# Altium schematic sheet TMC2208.SchDoc
size B
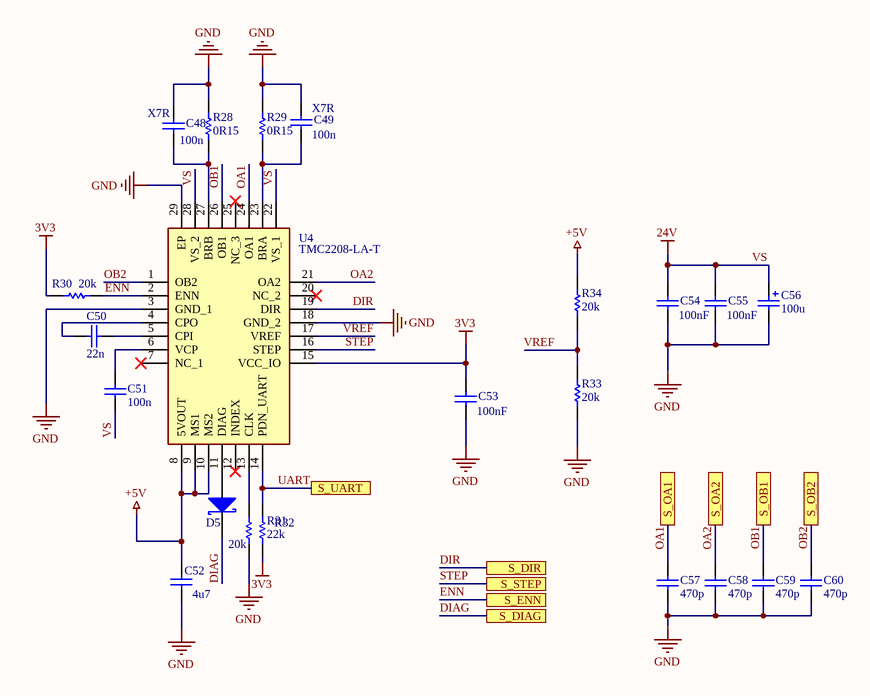
[diagram p0: TMC2208.SchDoc]

## Parts
C48  X7R  value 100n  [RAD-0.3]
C49  X7R  value 100n  [RAD-0.3]
C50  value 22n  [RAD-0.3]  (hidden comment: X5R)
C51  value 100n  [RAD-0.3]  (hidden comment: X5R)
C52  value 4u7  [RAD-0.3]  (hidden comment: X5R)
C53  value 100nF  [RAD-0.3]  (hidden comment: X5R)
C54  value 100nF  [RAD-0.3]  (hidden comment: X5R)
C55  value 100nF  [RAD-0.3]  (hidden comment: X5R)
C56  100u  [TAN-B]
C57  value 470p  [RAD-0.3]  (hidden comment: X5R)
C58  value 470p  [RAD-0.3]  (hidden comment: X5R)
C59  value 470p  [RAD-0.3]  (hidden comment: X5R)
C60  value 470p  [RAD-0.3]  (hidden comment: X5R)
D5  Diode BAT17  [SOT-23_N]  (value not drawn)
R28  value 0R15  [AXIAL-0.3]  (hidden comment: Res1)
R29  value 0R15  [AXIAL-0.3]  (hidden comment: Res1)
R30  value 20k  [AXIAL-0.3]  (hidden comment: Res1)
R31  value 22k  [AXIAL-0.3]  (hidden comment: Res1)
R32  value 20k  [AXIAL-0.3]  (hidden comment: Res1)
R33  value 20k  [AXIAL-0.3]  (hidden comment: Res1)
R34  value 20k  [AXIAL-0.3]  (hidden comment: Res1)
U4  TMC2208-LA-T  [QFN50P500X500X90-29N-D]

## Ports
S_DIAG, S_DIR, S_ENN, S_OA1, S_OA2, S_OB1, S_OB2, S_STEP, S_UART

## Nets
3V3: C53.1 R30.1 R31.1 U4.15(VCC_IO)
+5V: C52.1 R34.2 U4.8(5VOUT) U4.9(MS1) U4.10(MS2)
GND: C48.2 C49.1 C52.2 C53.2 C54.2 C55.2 C56.2 C57.1 C58.1 C59.1 C60.1 R28.2 R29.2 R32.1 R33.1 U4.3(GND_1) U4.18(GND_2) U4.29(EP)
VS: C51.1 C54.1 C55.1 C56.1 U4.22(VS_1) U4.28(VS_2)  [also labelled 24V]
DIAG: D5.3(K) ; port S_DIAG
DIR: U4.19(DIR) ; port S_DIR
ENN: R30.2 U4.2(ENN) ; port S_ENN
OA1: C57.2 U4.24(OA1) ; port S_OA1
OA2: C58.2 U4.21(OA2) ; port S_OA2
OB1: C59.2 U4.26(OB1) ; port S_OB1
OB2: C60.2 U4.1(OB2) ; port S_OB2
STEP: U4.16(STEP) ; port S_STEP
UART: R31.2 U4.14(PDN_UART) ; port S_UART
VREF: R33.2 R34.1 U4.17(VREF)
NetC48_1: C48.1 R28.1 U4.27(BRB)
NetC49_2: C49.2 R29.1 U4.23(BRA)
NetC50_1: C50.1 U4.4(CPO)
NetC50_2: C50.2 U4.5(CPI)
NetC51_2: C51.2 U4.6(VCP)
NetD5_1: D5.1(A) U4.11(DIAG)
NetR32_2: R32.2 U4.13(CLK)

Not connected (* = marked no-connect by the designer): U4 7(NC_1)* 12(INDEX)* 20(NC_2)* 25(NC_3)*

## Library data of the parts
C48-C55 C57-C60 = Cap: Capacitor; Published: 8-Jun-2000; LatestRevisionDate: 17-Jul-2002; LatestRevisionNote: Re-released for DXP Platform.; PackageReference: RAD-0.3; Publisher: Altium Limited; PackageDescription: Radial Cap, Thru-Hole; 2 Leads; 0.3 in Pin Spacing
C56 = Cap Pol1: Polarized Capacitor (Radial); Value: 10uF; Published: 8-Jun-2000; Revision: July-2002: Re-released for DXP Platform.; Publisher: Altium Limited
D5 = Diode BAT17: Silicon RF Schottky Diode for Mixer Applications in the VHF/UHF Range; Note: Pin 2 is not connected and not drawn.; Published: 21-Mar-2003; LatestRevisionDate: 29-May-2009; LatestRevisionNote: IPC-7351 Footprint Added.; DatasheetVersion: Oct-1999; PackageVersion: Sep-2001; PackageReference: SOT-23; Publisher: Altium Limited; PackageDescription: 3-Pin SOT-23 Package 0.95 mm Pitch, 2.5 mm Lead Span; ComponentLink1Description: Manufacturer Link; ComponentLink1URL: http://www.infineon.com/; ComponentLink2Description: Datasheet; ComponentLink2URL: http://www.infineon.com/upload/Document/cmc_upload/documents/009/363/bat17series.pdf
R28-R34 = Res1: Resistor; Published: 8-Jun-2000; LatestRevisionDate: 17-Jul-2002; LatestRevisionNote: Re-released for DXP Platform.; PackageReference: AXIAL-0.3; Publisher: Altium Limited; PackageDescription: Axial Device, Thru-Hole; 2 Leads; 0.3 in Pin Spacing
U4 = TMC2208-LA-T: Integrated Circuit; Manufacturer_Name: TRINAMIC; Datasheet Link: https://datasheet.datasheetarchive.com/originals/distributors/DKDS-23/450911.pdf; Height: 0.9mm; Manufacturer_Part_Number: TMC2208-LA-T; Mouser Part Number: 700-TMC2208-LA-T; Mouser Price/Stock: https://www.mouser.co.uk/ProductDetail/Trinamic/TMC2208-LA-T?qs=TiOZkKH1s2TUCbyrI5xF3A%3D%3D